# Altium project PCB_Project.PrjPcb
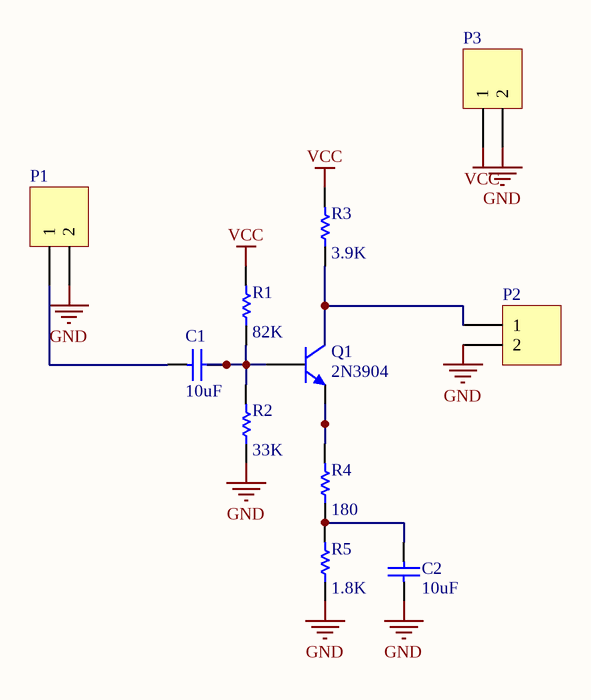
[diagram p0: Sheet1.SchDoc]
1 sheet, 11 parts. Net scope: global (net labels, ports and power ports of the same name join across sheets).
Board file: PCB1.PcbDoc

## Sheet Sheet1.SchDoc
size A

### Parts
C1  value 10uF  [RAD-0.3]  (hidden comment: Cap)
C2  value 10uF  [RAD-0.3]  (hidden comment: Cap)
P1  Header 2H  [HDR1X2H]  (value not drawn)
P2  Header 2H  [HDR1X2H]  (value not drawn)
P3  Header 2H  [HDR1X2H]  (value not drawn)
Q1  2N3904  [TO-92A]
R1  value 82K  [AXIAL-0.3]  (hidden comment: Res1)
R2  value 33K  [AXIAL-0.3]  (hidden comment: Res1)
R3  value 3.9K  [AXIAL-0.3]  (hidden comment: Res1)
R4  value 180  [AXIAL-0.3]  (hidden comment: Res1)
R5  value 1.8K  [AXIAL-0.3]  (hidden comment: Res1)

### Nets
GND: C2.1 P1.2 P2.2 P3.2 R2.1 R5.1
VCC: P3.1 R1.2 R3.2
NetC1_1: C1.1 P1.1
NetC1_2: C1.2 Q1.2(B) R1.1 R2.2
NetC2_2: C2.2 R4.1 R5.2
NetP2_1: P2.1 Q1.3(C) R3.1
NetQ1_1: Q1.1(E) R4.2

### Library data of the parts
C1 C2 = Cap: Capacitor; Published: 8-Jun-2000; LatestRevisionDate: 17-Jul-2002; LatestRevisionNote: Re-released for DXP Platform.; PackageReference: RAD-0.3; Publisher: Altium Limited; PackageDescription: Radial Cap, Thru-Hole; 2 Leads; 0.3 in Pin Spacing
P1-P3 = Header 2H: Header, 2-Pin, Right Angle; LatestRevisionDate: 17-Jul-2002; LatestRevisionNote: Re-released for DXP Platform.; Publisher: Altium Limited
Q1 = 2N3904: NPN General Purpose Amplifier; Published: 8-Jun-2000; LatestRevisionDate: 15-Jan-2003; LatestRevisionNote: PCB Footprint 'BCY-W3/D4.7' replaced; DatasheetVersion: 1997; PackageVersion: Sep-1998; PackageReference: TO-92A; Publisher: Altium Limited; PackageDescription: TO, Flat Index; 3 In-Line, Axial Leads; Body Dia. 4.5mm; Leads 0.51 x 0.48 mm (max); ComponentLink1Description: Manufacturer Link; ComponentLink1URL: http://www.fairchildsemi.com/; ComponentLink2Description: Datasheet; ComponentLink2URL: http://www.fairchildsemi.com/ds/2N%2F2N3904.pdf
R1-R5 = Res1: Resistor; Published: 8-Jun-2000; LatestRevisionDate: 17-Jul-2002; LatestRevisionNote: Re-released for DXP Platform.; PackageReference: AXIAL-0.3; Publisher: Altium Limited; PackageDescription: Axial Device, Thru-Hole; 2 Leads; 0.3 in Pin Spacing